# EAGLE schematic astable_sch (1) (EAGLE 8.7.0)
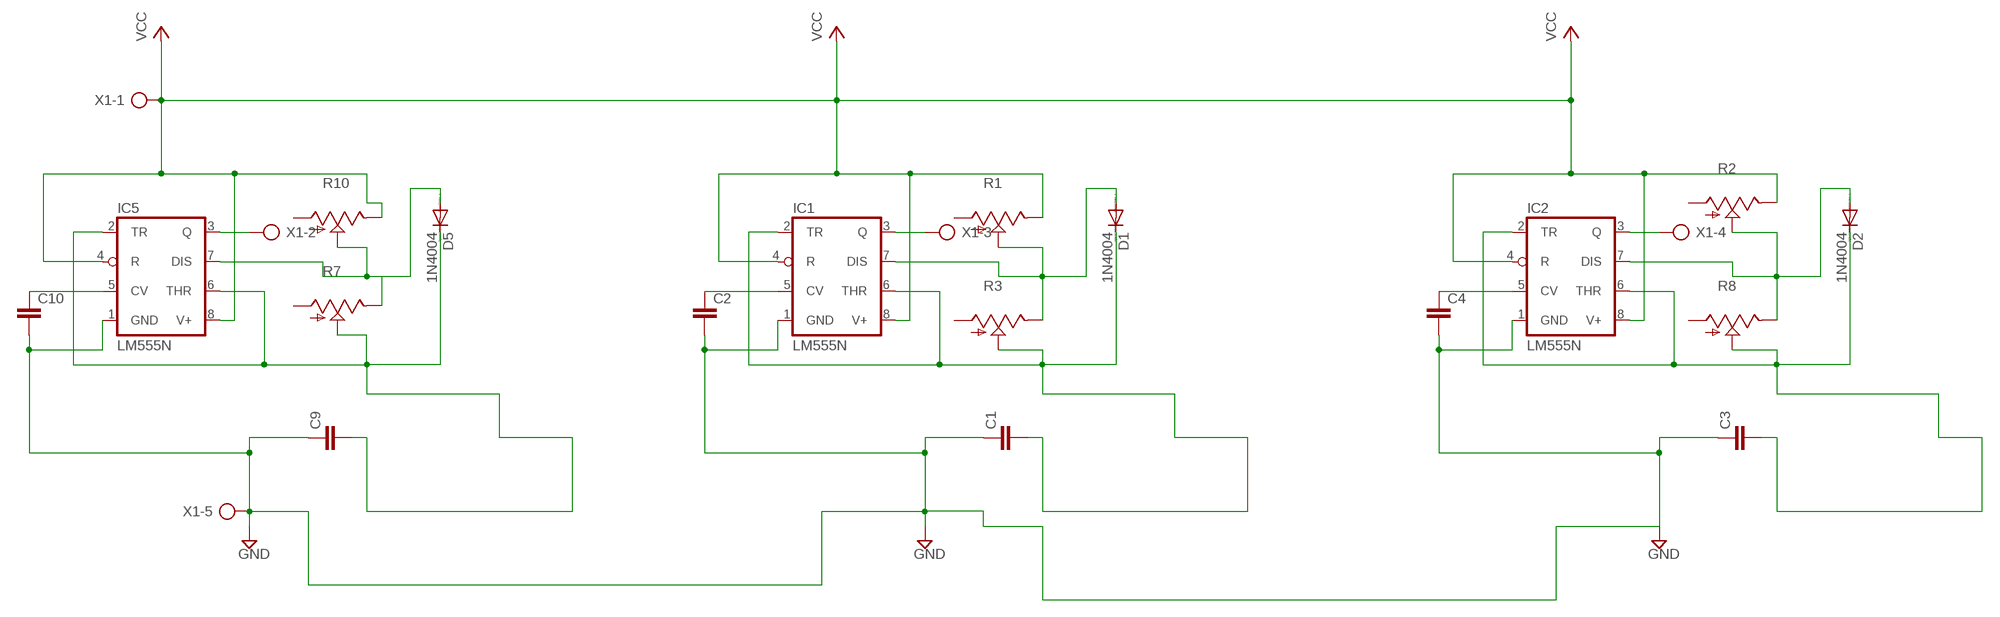
[diagram p0: schematic, sheet 1]

## Parts
C1  C-EU025-024X044  [C025-024X044]
C2  C-EU025-024X044  [C025-024X044]
C3  C-EU025-024X044  [C025-024X044]
C4  C-EU025-024X044  [C025-024X044]
C9  C-EU025-024X044  [C025-024X044]
C10  C-EU025-024X044  [C025-024X044]
D1  1N4004  [DO41-10]
D2  1N4004  [DO41-10]
D5  1N4004  [DO41-10]
IC1  LM555N  [DIL08]
IC2  LM555N  [DIL08]
IC5  LM555N  [DIL08]
R1  TRIM_US-B25V  [B25V]
R2  TRIM_US-B25V  [B25V]
R3  TRIM_US-B25V  [B25V]
R7  TRIM_US-B25V  [B25V]
R8  TRIM_US-B25V  [B25V]
R10  TRIM_US-B25V  [B25V]
X1  AK300/5  [AK300/5]

## Nets
GND: C1.1 C2.2 C3.1 C4.2 C9.1 C10.2 IC1.1(GND) IC2.1(GND) IC5.1(GND) X1.5
N$1: D1.A IC1.7(DIS) R1.S R3.E
N$2: C1.2 D1.C IC1.2(TR) IC1.6(THR) R3.S
N$3: C2.1 IC1.5(CV)
N$4: IC1.3(Q) X1.3
N$6: D2.A IC2.7(DIS) R2.S R8.E
N$7: C3.2 D2.C IC2.2(TR) IC2.6(THR) R8.S
N$8: C4.1 IC2.5(CV)
N$9: IC2.3(Q) X1.4
N$21: D5.A IC5.7(DIS) R7.E R10.S
N$22: C9.2 D5.C IC5.2(TR) IC5.6(THR) R7.S
N$23: C10.1 IC5.5(CV)
N$24: IC5.3(Q) X1.2
VCC: IC1.4(R) IC1.8(V+) IC2.4(R) IC2.8(V+) IC5.4(R) IC5.8(V+) R1.E R2.E R10.E X1.1
Unconnected: R1.A R2.A R3.A R7.A R8.A R10.A

## Library data of the parts
C1-C4 C9 C10 = rcl:C-EU: CAPACITOR, European symbol; SPICEPREFIX: C
D1 D2 D5 = diode:1N4004: DIODE general purpose rectifier, 1 A
IC1 IC2 IC5 = linear:*555: TIMER
R1-R3 R7 R8 R10 = pot:TRIM_US-: POTENTIOMETER
X1 = con-ptr500:AK300/5: CONNECTOR; OC_FARNELL: unknown; OC_NEWARK: unknown